# Altium schematic sheet V_10_.SchDoc
size A4
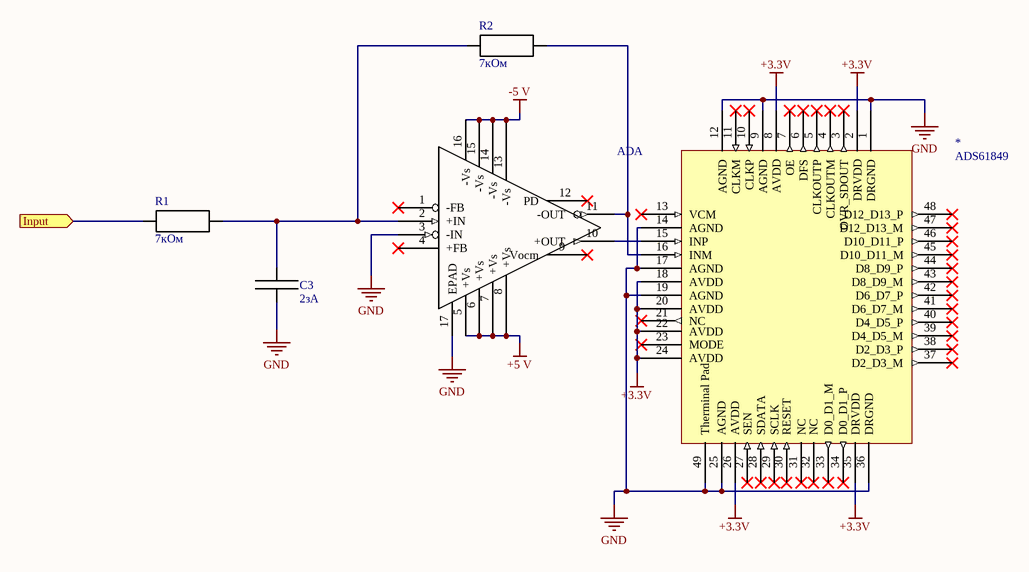
[diagram p0: V_10_.SchDoc]

## Parts
*  ADS61849  [ADS61B49]
?  ADA  [ADA]
C3  2зА  [condenser]
R1  7кОм  [resistor]
R2  7кОм  [resistor]

## Ports
Input (in)

## Nets
+3.3V: *.2(DRVDD) *.8(AVDD) *.18(AVDD) *.20(AVDD) *.22(AVDD) *.24(AVDD) *.26(AVDD) *.35(DRVDD)
+5 V: ?.5(+Vs) ?.6(+Vs) ?.7(+Vs) ?.8(+Vs)
-5 V: ?.13(-Vs) ?.14(-Vs) ?.15(-Vs) ?.16(-Vs)
GND: *.1(DRGND) *.9(AGND) *.12(AGND) *.14(AGND) *.17(AGND) *.19(AGND) *.25(AGND) *.36(DRGND) *.49(Therminal_Pad) ?.3(-IN) ?.17(EPAD) C3.2
Input: R1.2 ; port Input
Net*_15: *.15(INP) ?.10(+OUT)
Net*_16: *.16(INM) ?.11(-OUT) R2.3
Net?_2: ?.2(+IN) C3.3 R1.3 R2.2

Not connected (* = marked no-connect by the designer): * 3(OVR_SDOUT)* 4(CLKOUTM)* 5(CLKOUTP)* 6(DFS)* 7(OE)* 10(CLKP)* 11(CLKM)* 13(VCM)* 21(NC)* 23(MODE)* 27(SEN)* 28(SDATA)* 29(SCLK)* 30(RESET)* 31(NC)* 32(NC)* 33(D0_D1_M)* 34(D0_D1_P)* 37(D2_D3_M)* 38(D2_D3_P)* 39(D4_D5_M)* 40(D4_D5_P)* 41(D6_D7_M)* 42(D6_D7_P)* 43(D8_D9_M)* 44(D8_D9_P)* 45(D10_D11_M)* 46(D10_D11_P)* 47(D12_D13_M)* 48(D12_D13_P)*; ? 1(-FB)* 4(+FB)* 9(Vocm)* 12(PD)*

## Library data of the parts
C3 = condenser
R1 R2 = resistor